# Altium schematic sheet Gastroscopy-Controller_USB.SchDoc: USB
size 279 x 215 mm; Date: not used; ApprovedBy: not used; CheckedBy: not used; Author: not used; DrawnBy: not used; Organization: not used; Address4: not used; SheetNumber: 3; SheetTotal: 8; Time: not used; ImagePath: not used; Application_BuildNumber: not used
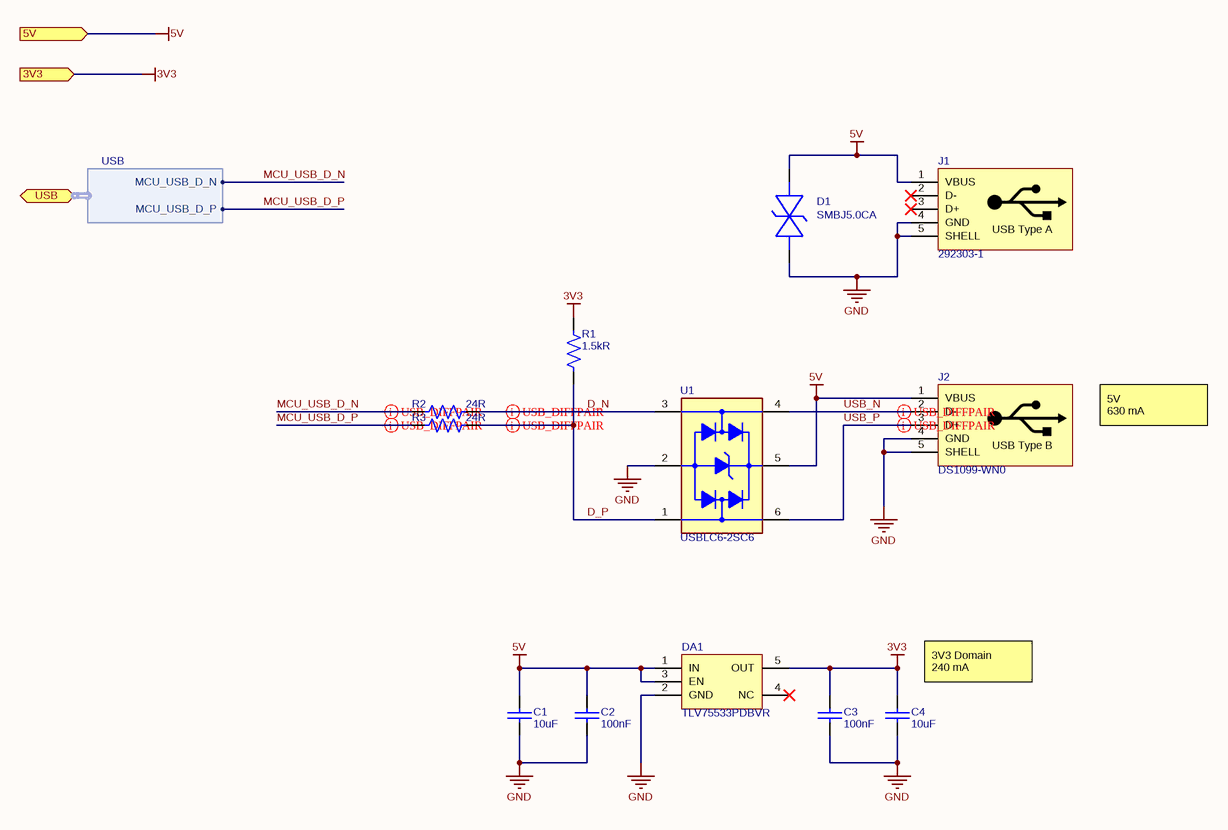
[diagram p0: Gastroscopy-Controller_USB.SchDoc]

## Parts
C1  10uF  [CAP_0805]
C2  100nF  [CAP_0603]
C3  100nF  [CAP_0603]
C4  10uF  [CAP_0805]
D1  SMBJ5.0CA  [SMB-BIDIR]
DA1  TLV75533PDBVR  [SOT-23-5]
J1  292303-1  [292303-1]
J2  DS1099-WN0  [DS1099-WN0]
R1  1.5kR  [RES_0603]
R2  24R  [RES_0603]
R3  24R  [RES_0603]
U1  USBLC6-2SC6  [SOT-23-6]

## Ports
3V3 (in), 5V (in), USB (bidir, harness USB)

## Harnesses
USB: MCU_USB_D_N, MCU_USB_D_P

## Nets
3V3: C3.1 C4.2 DA1.5(OUT) R1.1 ; port 3V3
5V: C1.2 C2.1 D1.1 DA1.1(IN) DA1.3(EN) J1.1(VBUS) J2.1(VBUS) U1.5(VBUS) ; port 5V
GND: C1.1 C2.2 C3.2 C4.1 D1.2 DA1.2(GND) J1.4(GND) J1.5(SHELL) J2.4(GND) J2.5(SHELL) U1.2(GND)
D_N: R2.2 U1.3(I/O_2)
D_P: R1.2 R3.2 U1.1(I/O_1)
MCU_USB_D_N: R2.1 ; port USB.MCU_USB_D_N
MCU_USB_D_P: R3.1 ; port USB.MCU_USB_D_P
USB_N: J2.2(D-) U1.4(I/O_3)
USB_P: J2.3(D+) U1.6(I/O_4)

Not connected (* = marked no-connect by the designer): DA1 4(NC)*; J1 2(D-)* 3(D+)*

## Layout directives
differential pair; differential pair class USB_DIFFPAIR: D_N, D_P, MCU_USB_D_N, MCU_USB_D_P, USB_N, USB_P

## Notes on the sheet
- 5V
  630 mA
- (near C4) 3V3 Domain
  240 mA
- Title:
- Date:
- Size A
- Project:
- Number:
- Time:
- Sheet
- Revision
- of
- Engineer:
- www.mrobots.ru <http://mrobots.ru/>
- File:
- (in symbol 292303-1) USB Type A
- (in symbol DS1099-WN0) USB Type B

## Library data of the parts
C1 C4 = CL21B106KOQNNNE: CAP CER 10UF 16V X7R 0805; Manufacturer 1: Samsung; Tolerance: 10%; Supplier 1: Avnet; Manufacturer Part Number 1: CL21B106KOQNNNE; RoHS: Yes; Category: Ceramic Capacitors; Stock 1: 1089000; Pricing 1: 2000=0,02892, 4000=0,02851, 8000=0,02768, 12000=0,02707, 16000=0,02603 (USD); Mount: Surface Mount; Case/Package: 0805; Case Code (Metric): 2012; Case Code (Imperial): 0805; Contact Plating: Tin; Min Operating Temperature: -55°C; Max Operating Temperature: 125°C; Packaging: Tape and Reel; Capacitance: 10uF; Voltage Rating: 16V; Package Quantity: 1; Dielectric: X7R; Series: CL; Construction: Flat; Voltage: 16V; Length: 2mm; Width: 0.049inch; Height: 1.25mm; Thickness: 0.055inch; Depth: 1.25mm; Radiation Hardening: No; RoHS Compliant: Yes; ComponentLink1URL: https://datasheet.ciiva.com/25794/cl21b106koqnnne-25794472.pdf?src-supplier=Digi-Key; ComponentLink1Description: https://datasheet.ciiva.com/25794/cl21b106koqnnne-25794472.pdf?src-supplier=Digi-Key; ComponentLink2URL: https://datasheet.ciiva.com/16428/cl21b106koqnnne-16428887.pdf?src-supplier=Future+Electronics; ComponentLink2Description: https://datasheet.ciiva.com/16428/cl21b106koqnnne-16428887.pdf?src-supplier=Future+Electronics; ComponentLink3URL: https://datasheet.ciiva.com/26920/getdatasheetpartid-355170-26920201.pdf?src-supplier=Verical; ComponentLink3Description: https://datasheet.ciiva.com/26920/getdatasheetpartid-355170-26920201.pdf?src-supplier=Verical; Supplier Part Number 1: CL21B106KOQNNNE
C2 C3 = CL10B104KB8NNNL: CAP CER 0.1UF 50V X7R 0603; Manufacturer 1: Samsung; Tolerance: 10%; Supplier 1: Digi-Key; Manufacturer Part Number 1: CL10B104KB8NNNL; RoHS: Yes; Category: Ceramic Capacitors; Stock 1: 2348404; Pricing 1: 15000=0,00532, 30000=0,00506 (USD); Mount: Surface Mount; Case/Package: 0603; Min Operating Temperature: -55°C; Max Operating Temperature: 125°C; Capacitance: 100nF; Packaging: Tape and Reel; Package Quantity: 15000; Voltage Rating: 50V; Dielectric: X7R; Voltage Rating (DC): 50V; Series: CL; Construction: Flat; Length: 1.6mm; Width: 0.031inch; Height: 0.8mm; Thickness: 0.035inch; Depth: 0.8mm; Radiation Hardening: No; RoHS Compliant: Yes; ComponentLink1URL: https://datasheet.ciiva.com/26838/getdatasheetpartid-357523-26838415.pdf?src-supplier=Verical; ComponentLink1Description: https://datasheet.ciiva.com/26838/getdatasheetpartid-357523-26838415.pdf?src-supplier=Verical; ComponentLink2URL: https://datasheet.ciiva.com/25741/cl10b104kb8nnnl-25741341.pdf?src-supplier=Digi-Key; ComponentLink2Description: https://datasheet.ciiva.com/25741/cl10b104kb8nnnl-25741341.pdf?src-supplier=Digi-Key; Supplier Part Number 1: 1276-CL10B104KB8NNNLTR-ND
D1 = SMBJ5.0CA: TVS DIODE 5VWM 9.2VC SMB; Manufacturer 1: Bourns; Direction: Bidirectional; Max Surge Current: 100A; Reverse Breakdown Voltage: 6.4V; Reverse Standoff Voltage: 5V; Clamping Voltage: 9.2V; Peak Pulse Power: 600W; Breakdown Voltage: 7.25V; Max Reverse Leakage Current: 1.6mA; Test Current: 10mA; Number of Elements: 1; Peak Pulse Current: 65.2A; Element Configuration: Single; Diode Type: ZENER; Operating Supply Voltage: 3.5V; Power Line Protection: No; Supplier 1: Arrow Electronics; RoHS: Yes; Category: TVS Diodes; Stock 1: 3000; Pricing 1: 3000=0,10850, 6000=0,10460, 15000=0,10360, 30000=0,10260 (USD); Mount: Surface Mount; Case/Package: DO-214AA; Number of Pins: 2; Min Operating Temperature: -55°C; Max Operating Temperature: 150°C; Packaging: Tape and Reel; Package Quantity: 1; Min Breakdown Voltage: 6.4V; Polarity: Bidirectional; Termination: SMD/SMT; Max Breakdown Voltage: 7.25V; Leakage Current: 1.6mA; Series: SMBJ; Number of Bidirectional Channels: 1; Number of Channels: 1; Max Power Dissipation: 600W; Resistor Type: Zener; Radiation Hardening: No; RoHS Compliant: Yes; REACH SVHC: No SVHC; ComponentLink1URL: https://datasheet.ciiva.com/334/smbj-334706.pdf?src-supplier=Digi-Key; ComponentLink1Description: https://datasheet.ciiva.com/334/smbj-334706.pdf?src-supplier=Digi-Key; ComponentLink2URL: https://datasheet.ciiva.com/3022/smbj-3022578.pdf?src-supplier=Avnet; ComponentLink2Description: https://datasheet.ciiva.com/3022/smbj-3022578.pdf?src-supplier=Avnet; ComponentLink3URL: https://datasheet.ciiva.com/334/smbj-334707.pdf?src-supplier=Digi-Key; ComponentLink3Description: https://datasheet.ciiva.com/334/smbj-334707.pdf?src-supplier=Digi-Key; ComponentLink4URL: https://datasheet.ciiva.com/334/smbj-334708.pdf?src-supplier=Digi-Key; ComponentLink4Description: https://datasheet.ciiva.com/334/smbj-334708.pdf?src-supplier=Digi-Key; ComponentLink5URL: https://datasheet.ciiva.com/28410/1677318-28410120.pdf?src-supplier=Element14; ComponentLink5Description: https://datasheet.ciiva.com/28410/1677318-28410120.pdf?src-supplier=Element14; ComponentLink6URL: https://datasheet.ciiva.com/8031/1677318-8031161.pdf?src-supplier=Element14; ComponentLink6Description: https://datasheet.ciiva.com/8031/1677318-8031161.pdf?src-supplier=Element14; ComponentLink7URL: https://datasheet.ciiva.com/30104/smbj-30104446.pdf?src-supplier=Onlinecomponents.com; ComponentLink7Description: https://datasheet.ciiva.com/30104/smbj-30104446.pdf?src-supplier=Onlinecomponents.com; Supplier Part Number 1: SMBJ5.0CA; Manufacturer Part Number 1: SMBJ5.0CA
DA1 = TLV75533PDBVR: IC REG LINEAR 3.3V 500MA SOT23-5; Manufacturer 1: Texas Instruments; Output Type: Fixed; Output Configuration: Positive; Number of Regulators: 1; Max Input Voltage: 5.5V; Dropout Voltage: 238mV; Quiescent Current: 31uA; Power Supply Rejection Ratio (PSRR): 52dB; Supplier 1: Mouser; RoHS: Yes; Category: Voltage Regulators - Linear; Stock 1: 90; Pricing 1: 1=0,46000, 10=0,39400, 50=0,39400, 100=0,27300, 1000=0,17900, 10000=0,16200 (USD); Mount: Surface Mount; Case/Package: SOT-23-5; Min Operating Temperature: -40°C; Max Operating Temperature: 125°C; Packaging: Cut Tape; Min Output Voltage: 3.3V; Max Output Voltage: 3.3V; Output Current: 500mA; RoHS Compliant: Yes; ComponentLink1URL: http://www.ti.com/lit/ds/symlink/tlv755p.pdf?src-supplier=Digi-Key; ComponentLink1Description: http://www.ti.com/lit/ds/symlink/tlv755p.pdf?src-supplier=Digi-Key; ComponentLink2URL: http://www.ti.com/general/docs/suppproductinfo.tsp?distId=10&amp;gotoUrl=http%3A%2F%2Fwww.ti.com%2Flit%2Fgpn%2Ftlv755p&src-supplier=Digi-Key; ComponentLink2Description: http://www.ti.com/general/docs/suppproductinfo.tsp?distId=10&amp;gotoUrl=http%3A%2F%2Fwww.ti.com%2Flit%2Fgpn%2Ftlv755p&src-supplier=Digi-Key; Supplier Part Number 1: 595-TLV75533PDBVR; Manufacturer Part Number 1: TLV75533PDBVR
J1 = 292303-1: CONN RCPT USB2.0 TYPEA 4POS R/A; Manufacturer 1: TE Connectivity; Description: Conn USB 2.0 Type A RCP 4 POS 2mm/2.5mm Solder RA Thru-Hole 4 Terminal 1 Port Box/Tube; Number of Terminals/Pins: 4; Plating: Bright,Tin; Gender: Receptacle; Number of Ports: 1; Contact Current Rating: 1A; Circuit Application: Signal; Connector System: Cable-to-Board; Shielding: Shielded; Insulation Resistance: 1GR; Voltage Rating (AC): 30V; Mode: Singlemode; Plating Thickness: 0.76um; PCB Thickness: 0.062inch; Pitch: 2.5mm; Tail Length: 0.112inch; Approvals: UL; Supplier 1: RSComponents; Manufacturer Part Number 1: 292303-1; RoHS: Yes; Category: Audio / Video Connectors; Stock 1: 2945; Pricing 1: 125=1,33200, 375=1,19600, 1000=1,13200, 2000=1,08000 (GBP); Mount: Through Hole,Horizontal; Contact Plating: Gold; Contact Material: Copper Alloy,Copper; Color: Black; Housing Material: Thermoplastic; Housing Color: Black; Insulation Color: Black; Min Operating Temperature: -67°C; Max Operating Temperature: 185°C; Packaging: Rail/Tube; Package Quantity: 30; Connector Type: Receptacle; Termination: Through Hole; Number of Contacts: 4; Number of Positions: 4; Orientation: Right Angle; USB Standard: USB 2.0; Series: -; Current Rating: 1A; Length: 14.63mm; Depth: 14mm; Reach SVHC Compliant: Yes; Flammability Rating: UL94 V-0; RoHS Compliant: Yes; Halogen Free: Halogen Free; Supplier Part Number 1: 5298195P
J2 = DS1099-WN0: CONN TYPE B SKT HORIZONTAL TH; Manufacturer 1: Ningbo Connfly Electric; Manufacturer Part Number 1: DS1099-WN0
R1 = RC0603FR-071K5L: RES 1.5K OHM 1% 1/10W 0603; Manufacturer 1: Yageo; Voltage Rating (DC): 50V; Temperature Coefficient: 100ppm/°C; Power Rating: 100mW; Supplier 1: Arrow Electronics; RoHS: Yes; Category: Chip SMD Resistors; Stock 1: 15000; Pricing 1: 5000=0,00350 (USD); Case/Package: 0603; Number of Pins: 2; Case Code (Metric): 1608; Case Code (Imperial): 0603; Size Code: 0603; Min Operating Temperature: -55°C; Max Operating Temperature: 155°C; Tolerance: 1%; Packaging: Tape and Reel; Resistance: 1.5kR; Resistor Type: Thick Film; Voltage Rating: 50V; Package Quantity: 1; Number of Terminations: 2; Termination: SMD/SMT; Max Power Dissipation: 100mW; Features: Moisture Resistant; Series: RC; Resistance Tolerance: 1%; Construction: Rectangular; Length: 0.063inch; Width: 0.031inch; Height: 0.022inch; Depth: 0.8mm; REACH SVHC: No SVHC; Lead Free: Lead Free; Military Standard: Not; RoHS Compliant: Yes; ComponentLink1URL: https://datasheet.ciiva.com/46440/1868787-46440895.pdf?src-supplier=Element14; ComponentLink1Description: https://datasheet.ciiva.com/46440/1868787-46440895.pdf?src-supplier=Element14; ComponentLink2URL: https://datasheet.ciiva.com/2454/pyu-r-int-thick-7-2454514.pdf?src-supplier=Digi-Key; ComponentLink2Description: https://datasheet.ciiva.com/2454/pyu-r-int-thick-7-2454514.pdf?src-supplier=Digi-Key; ComponentLink3URL: https://datasheet.ciiva.com/2454/pyu-r-int-thick-7-2454515.pdf?src-supplier=Digi-Key; ComponentLink3Description: https://datasheet.ciiva.com/2454/pyu-r-int-thick-7-2454515.pdf?src-supplier=Digi-Key; ComponentLink4URL: https://datasheet.ciiva.com/2454/pyu-r-int-thick-7-2454513.pdf?src-supplier=Digi-Key; ComponentLink4Description: https://datasheet.ciiva.com/2454/pyu-r-int-thick-7-2454513.pdf?src-supplier=Digi-Key; Supplier Part Number 1: RC0603FR-071K5L; Manufacturer Part Number 1: RC0603FR-071K5L
R2 R3 = RC0603FR-0724RL: RES 24 OHM 1% 1/10W 0603; Manufacturer 1: Yageo; Power Rating: 100mW; Voltage Rating (DC): 50V; Temperature Coefficient: 100ppm/°C; Working Voltage: 75V; Supplier 1: Arrow Electronics; RoHS: Yes; Category: Chip SMD Resistors; Stock 1: 90000; Pricing 1: 5000=0,00190, 125000=0,00160 (USD); Case/Package: 0603; Case Code (Imperial): 0603; Case Code (Metric): 1608; Min Operating Temperature: -55°C; Max Operating Temperature: 155°C; Tolerance: 1%; Resistance: 24R; Packaging: Tape and Reel; Voltage Rating: 50V; Termination: SMD/SMT; Number of Terminations: 2; Features: Moisture Resistant; Series: RC; Max Power Dissipation: 100mW; Lead Free: Lead Free; RoHS Compliant: Yes; Supplier Part Number 1: RC0603FR-0724RL; Manufacturer Part Number 1: RC0603FR-0724RL
U1 = USBLC6-2SC6: TVS DIODE 5.25VWM 17VC SOT23-6; Manufacturer 1: STMicroelectronics; Direction: Unidirectional,Bidirectional; Capacitance: 3.5pF; Operating Supply Voltage: 1.1V; Number of Channels: 2; Breakdown Voltage: 6V; Clamping Voltage: 17V; Reverse Standoff Voltage: 5.25V; Power Line Protection: Yes; Test Current: 1mA; Max Reverse Leakage Current: 150nA; Peak Pulse Current: 5A; Element Configuration: Dual; Data Rate: 480Mbps; Number of Elements: 1; Working Voltage: 5V; Supplier 1: Digi-Key; RoHS: Yes; Category: TVS Diodes; Pricing 1: 1=0.63000, 10=0.54200, 100=0.40440, 500=0.31774, 1000=0.24553 (USD); Mount: Surface Mount; Case/Package: SOT-23; Number of Pins: 6; Contact Plating: Tin,Matte; Min Operating Temperature: -40°C; Max Operating Temperature: 125°C; Packaging: Tape and Reel; Package Quantity: 3000; Termination: SMD/SMT; Number of Bidirectional Channels: 2; Min Breakdown Voltage: 6V; ESD Protection: Yes; Leakage Current: 150nA; Series: USB; Reverse Breakdown Voltage: 6V; Polarity: Unidirectional,Bidirectional; Max Breakdown Voltage: 6V; Clamping Voltage-Max: 17V; Length: 3.05mm; Width: 1.75mm; Height: 1.3mm; Depth: 1.75mm; Radiation Hardening: No; REACH SVHC: No SVHC; Lead Free: Lead Free; RoHS Compliant: Yes; ComponentLink1URL: https://datasheet.ciiva.com/1268/1690354-1268384.pdf?src-supplier=Element14; ComponentLink1Description: https://datasheet.ciiva.com/1268/1690354-1268384.pdf?src-supplier=Element14; ComponentLink2URL: https://datasheet.ciiva.com/4508/cd00050750-113117-4508433.pdf?src-supplier=Mouser; ComponentLink2Description: https://datasheet.ciiva.com/4508/cd00050750-113117-4508433.pdf?src-supplier=Mouser; ComponentLink3URL: https://datasheet.ciiva.com/15143/getdatasheetpartid-148465-15143789.pdf?src-supplier=Verical; ComponentLink3Description: https://datasheet.ciiva.com/15143/getdatasheetpartid-148465-15143789.pdf?src-supplier=Verical; ComponentLink4URL: https://datasheet.ciiva.com/16200/cd00050750-16200026.pdf?src-supplier=Future+Electronics; ComponentLink4Description: https://datasheet.ciiva.com/16200/cd00050750-16200026.pdf?src-supplier=Future+Electronics; ComponentLink5URL: https://datasheet.ciiva.com/41444/001184109-da-01-en-ic-esd-protecti-usblc6-2sc6-sot-23-6-stm-41444156.pdf?src-supplier=Conrad; ComponentLink5Description: https://datasheet.ciiva.com/41444/001184109-da-01-en-ic-esd-protecti-usblc6-2sc6-sot-23-6-stm-41444156.pdf?src-supplier=Conrad; Supplier Part Number 1: 497-5235-6-ND; Manufacturer Part Number 1: USBLC6-2SC6